# EAGLE board pc_badge_hrv (EAGLE 6.6.0)
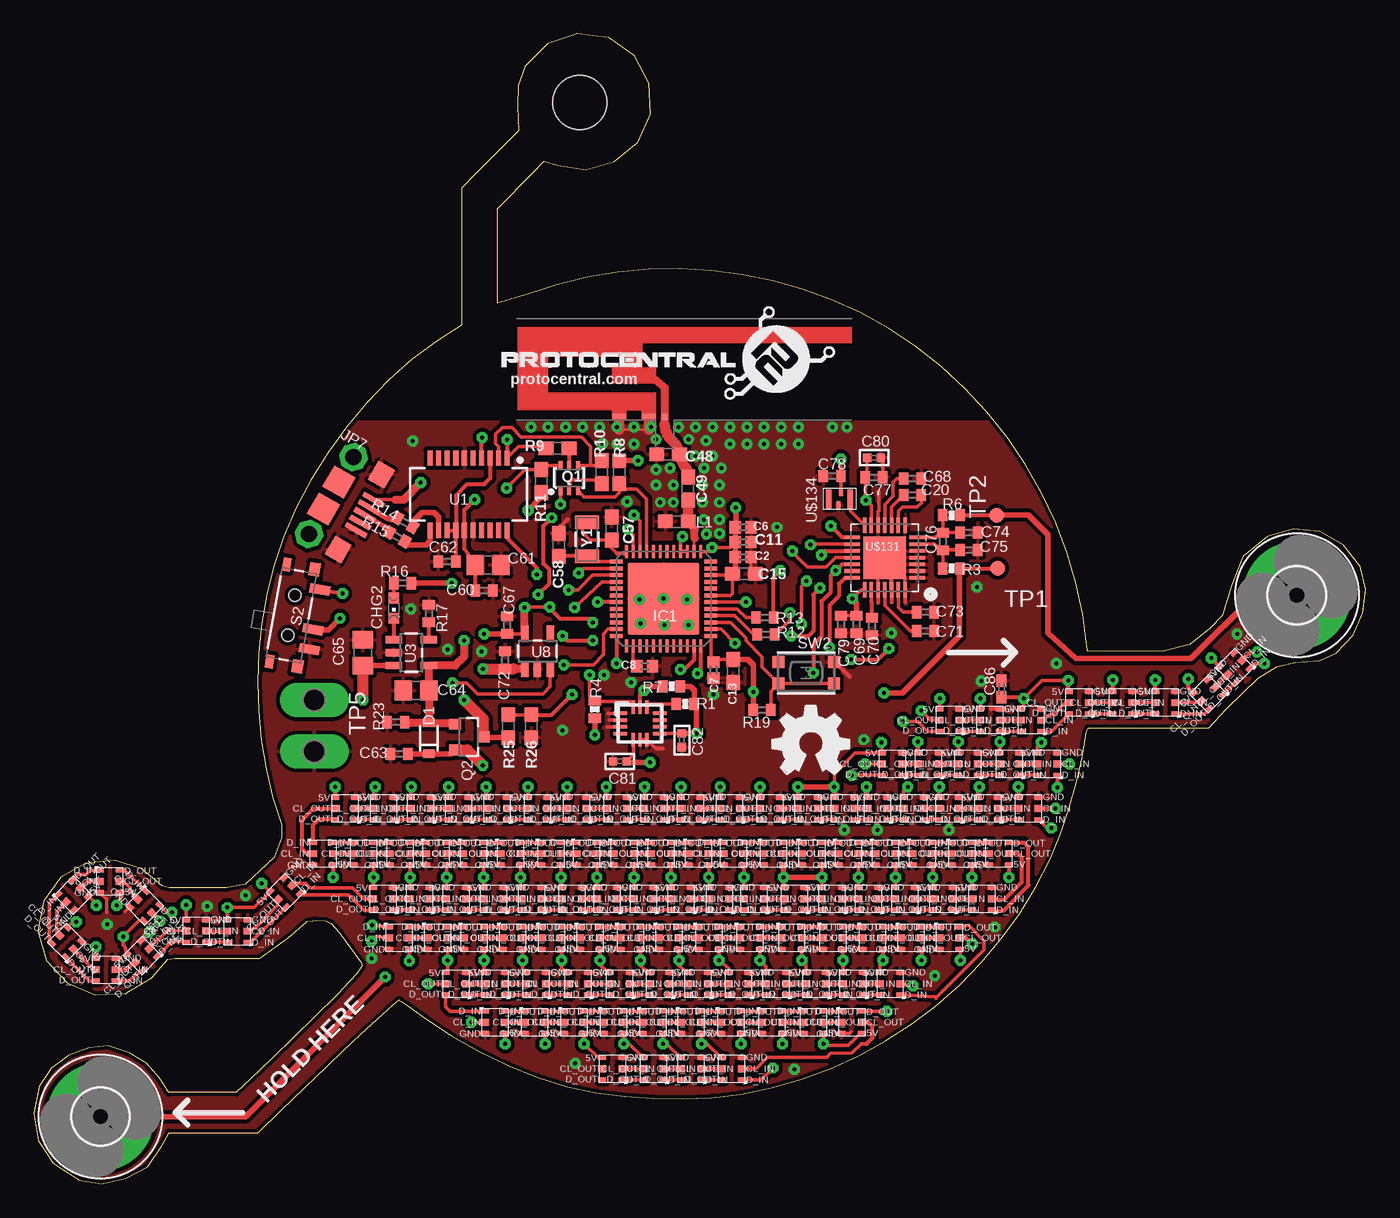
[diagram p3: board, top side]
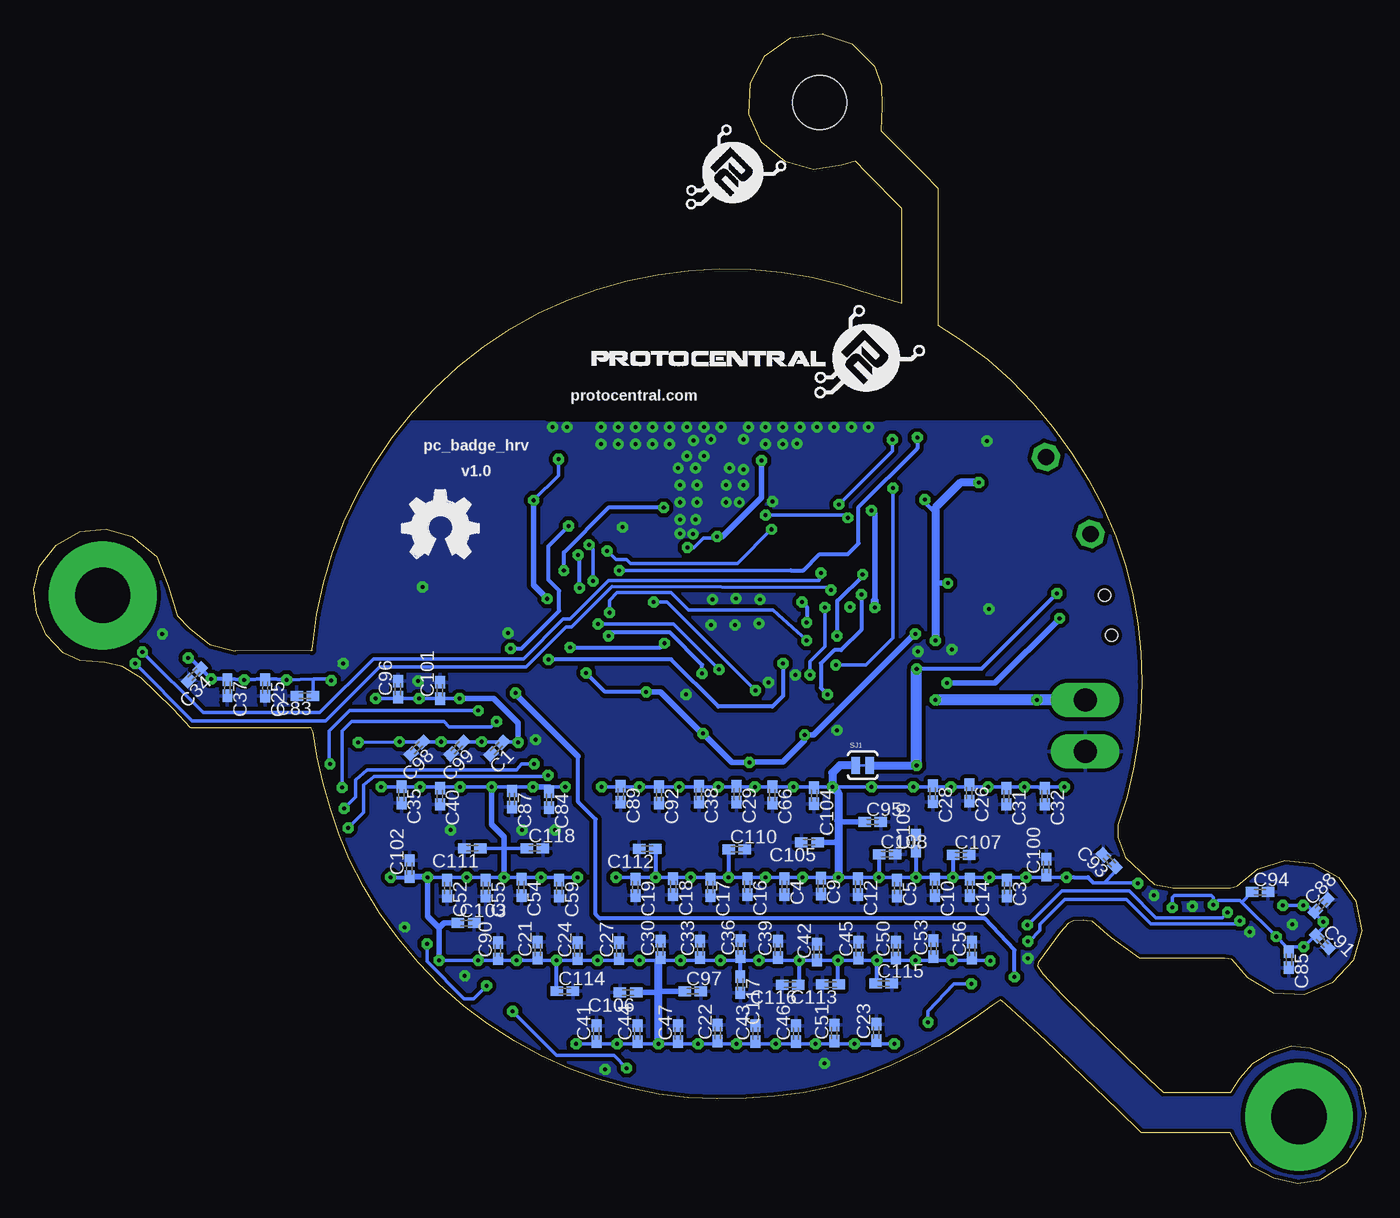
[diagram p4: board, bottom side, seen from below]

Size 98.76 x 85.28 mm. Coordinates in mm from the lower left corner, seen from the top.
Outline: 40.2,85.22 38.09,84.54 36.44,82.88 35.9,81.43 35.86,79.88 35.93,78.09 34.89,77.04 33.86,76 32.78,74.92 31.71,73.84 31.71,63.67 29.96,62.53 28.07,61.15 26.31,59.59 24.69,57.9 23.19,56.1 21.81,54.2 20.56,52.22 19.46,50.15 18.52,48 17.77,45.78 17.27,43.68 16.9,41.54 16.68,39.39 16.61,37.23 16.67,35.06 16.88,32.91 17.23,30.77 17.72,28.66 18.37,26.6 18.37,26.27 18.37,25.68 17.82,24.22 15.68,22.21 14.27,21.93
Outline: 14.31,21.94 10.05,21.96 9.53,22.09 8.02,23.34 5.99,24 3.87,23.76 2.01,22.71 0.75,20.99 0.31,18.76 0.95,16.58 2.47,14.9 4.55,14.01 6.81,14.12 8.75,15.27 9.95,16.64 10.46,16.73 16.73,16.73 18.86,18.24 20.28,19.45 20.69,19.51 20.94,19.52 21.66,19.5 22.06,19.3 22.65,18.65 23.47,17.54 24.29,16.43 24.33,16.17 23.94,15.57 22.44,13.98 20.88,12.44 19.27,10.87 17.66,9.31 16.04,7.75 15.01,6.78 10.02,6.78 9.35,7.84 8.36,8.95 7.07,9.7 5.54,10.25 4.12,10.1 2.6,9.54 1.31,8.58 0.42,7.23 0,5.23 0.34,3.22 1.45,1.51 3.22,0.39
Outline: 3.21,0.4 3.42,0.27 5.02,0 6.83,0.4 8.43,1.28 9.54,2.84 10.03,3.8 16.63,3.8 18.35,5.46 20.07,7.11 21.79,8.76 23.01,9.93 24.24,11.09 25.48,12.23 26.66,13.28 27,13.57 27.09,13.63 27.11,13.62 27.25,13.55 27.7,13.25 29.02,12.28 30.97,10.97 33.03,9.82 35.16,8.81 37.34,7.92 39.59,7.2 41.69,6.76 43.82,6.49 45.96,6.33 48.11,6.3 50.26,6.4 52.39,6.65 54.65,7.11 56.87,7.74 59.03,8.53 61.13,9.49 63.16,10.6 65.09,11.85 66.86,13.17 68.66,14.77 70.27,16.42 71.76,18.19 73.11,20.06 74.31,22.03 75.36,24.08 76.11,25.93 76.76,27.81 77.31,29.72 77.73,31.66 78.06,33.51 78.19,33.79 87.13,33.79 88.43,35.2 89.67,36.44 90.78,37.49 92.19,38.35 93.5,38.66 95.35,38.8 96.59,39.38 97.82,40.68 98.54,42.33 98.76,44.07 98.34,45.77 97.1,47.35 95.36,48.35 93.37,48.56 91.44,47.99 89.64,46.51 88.78,44.34 88.14,42.15 87.23,41.23 85.71,40 83.81,39.51
Outline: 78.14,39.5 78.09,39.83 77.78,42.21 77.27,44.56 76.59,46.86 75.73,49.1 74.7,51.27 73.51,53.35 72.17,55.34 70.68,57.21 69.05,58.97 67.29,60.6 65.4,62.09 63.41,63.42 61.31,64.59 59.12,65.57 56.96,66.35 54.74,66.96 52.49,67.42 50.21,67.71 47.92,67.84 45.62,67.81 43.33,67.6 41.06,67.23 38.83,66.68 36.65,65.95 34.38,65.32
Outline: 34.41,65.31 34.41,72.31 35.26,73.19 36.12,74.07 36.97,74.95 37.82,75.82 38.84,75.51 40.96,75.21 43.02,75.78 44.8,77.22 45.72,79.31 45.62,81.6 44.55,83.63 42.64,84.96 41.42,85.12 40.3,85.28 40.2,85.28
Outline: 78.1,39.53 83.82,39.52
Copper layers (1*2*15*16): Top 0.035mm / dielectric 1.5mm / Route2 0.035mm / dielectric 0.15mm / Route15 0.035mm / dielectric 0.2mm / Bottom 0.035mm
Design rules "Circuitects-Rules": minimum track width 6mil, minimum drill 0.3mm, track to track 6mil, track to pad 6mil, pad to pad 6mil, via to via 6mil, smd to smd 6mil, copper to edge 10mil, drill to drill 8mil, minimum pad ring 12mil, minimum via ring 10mil, stop-mask expansion 4mil, vias tented up to drill 25mil, thermal gap 10mil
Net classes: 2 gnd: width 0.102 mm, drill 0.1 mm; 4 USBpair: width 0.102 mm, drill 0.1 mm, clearance 0.15 mm to class 3
Holes 4 mm at 40.5,80.18

## Footprints (pad centres in the part's own frame; a part is rotated, then mirrored left to right if it is on the bottom)
C0402K = smd 0.925 x 0.74: 1 -0.6,0; 2 0.6,0
0402 = smd 0.85 x 0.9: 1 -0.58,0; 2 0.58,0
0603 = smd 1.1 x 1: 1 -0.85,0; 2 0.85,0
C0402 = smd 0.7 x 0.9: 1 -0.65,0; 2 0.65,0
C0805 = smd 1.3 x 1.5: 1 -0.95,0; 2 0.95,0
_0402 = smd 0.6 x 0.6: 1 -0.508,0; 2 0.508,0
CHIPLED_0603 = smd 0.8 x 0.8: A 0,-0.75; C 0,0.75
SOD-323 = smd 0.63 x 0.83: A 1.15,0; C -1.15,0
TRACE_ANTENNA_2.4GHZ_25.7MM_TUNED = smd 0.46 x 0.46: ANT 0,0.23 | smd 1 x 0.46: GND -1.18,0.23; GND2 -3.38,0.23
4,1-PAD = drill 4.1 pad 8: B4,1 0,0
QFN48 = smd 1 x 0.3: 1 -3.5,2.75; 2 -3.5,2.25; 3 -3.5,1.75; 4 -3.5,1.25; 5 -3.5,0.75; 6 -3.5,0.25; 7 -3.5,-0.25; 8 -3.5,-0.75; 9 -3.5,-1.25; 10 -3.5,-1.75; 11 -3.5,-2.25; 12 -3.5,-2.75; 25 3.5,-2.75; 26 3.5,-2.25; 27 3.5,-1.75; 28 3.5,-1.25; 29 3.5,-0.75; 30 3.5,-0.25; 31 3.5,0.25; 32 3.5,0.75; 33 3.5,1.25; 34 3.5,1.75; 35 3.5,2.25; 36 3.5,2.75 | smd 0.3 x 1: 13 -2.75,-3.5; 14 -2.25,-3.5; 15 -1.75,-3.5; 16 -1.25,-3.5; 17 -0.75,-3.5; 18 -0.25,-3.5; 19 0.25,-3.5; 20 0.75,-3.5; 21 1.25,-3.5; 22 1.75,-3.5; 23 2.25,-3.5; 24 2.75,-3.5; 37 2.75,3.5; 38 2.25,3.5; 39 1.75,3.5; 40 1.25,3.5; 41 0.75,3.5; 42 0.25,3.5; 43 -0.25,3.5; 44 -0.75,3.5; 45 -1.25,3.5; 46 -1.75,3.5; 47 -2.25,3.5; 48 -2.75,3.5 | smd 5.309 x 5.309: EXP 0,0
MICRO-B = smd 0.4 x 1.75: 1 -1.25,2.975; 2 -0.6,2.975; 3 0.05,2.975; 4 0.7,2.975; 5 1.35,2.975 | smd 1.8 x 1.8: P$1 -1.1,0.1; P$2 1.2,0.1 | drill 1.2 pad 2 octagon: P$3 -3.25,0.1; P$4 3.35,0.1 | smd 1.6 x 1.4: P$5 -3.15,2.55; P$6 3.25,2.55
SC70-6 = smd 0.3 x 0.66: 1 -0.65,-0.92; 2 0,-0.92; 3 0.65,-0.92; 4 0.65,0.92; 5 0,0.92; 6 -0.65,0.92
SOT23-3 = smd 0.8 x 0.9: 1 -0.95,-1; 2 0.95,-1; 3 0,1.1
0402-RES = smd 0.7 x 0.9: 1 -0.65,0; 2 0.65,0
R0402 = smd 0.7 x 0.9: 1 -0.65,0; 2 0.65,0
SWITCH-SPST-SMD-A = smd 0.7 x 1.5: 1 -2.25,-1.75; 2 -0.75,-1.75; 3 2.25,-1.75 | smd 1 x 0.6: GND1 -3.65,1; GND3 3.65,1 | smd 1 x 0.8: GND2 -3.65,-1.1; GND4 3.65,-1.1 | hole 0.9: -1.5,0; 1.5,0
SJ_2S-TRACE = smd 0.635 x 1.27: 1 -0.508,0; 2 0.508,0
BTN_KMR2_4.6X2.8 = smd 0.9 x 0.9: A 2.05,0.8; A' -2.05,0.8; B 2.05,-0.8; B' -2.05,-0.8
TP11R = smd 1.1 x 1.1: TP 0,0
P2-38-17 = drill 1.702 pad 2.121 long: TP-1 -1.905,0; TP-2 1.905,0
SSOP20_L = smd 0.381 x 1.143: 1 -2.857,-2.68; 2 -2.223,-2.68; 3 -1.587,-2.68; 4 -0.953,-2.68; 5 -0.318,-2.68; 6 0.318,-2.68; 7 0.953,-2.68; 8 1.587,-2.68; 9 2.223,-2.68; 10 2.857,-2.68; 11 2.857,2.68; 12 2.223,2.68; 13 1.587,2.68; 14 0.953,2.68; 15 0.318,2.68; 16 -0.318,2.68; 17 -0.953,2.68; 18 -1.587,2.68; 19 -2.223,2.68; 20 -2.857,2.68
LGA14L = smd 1 x 0.25: 1 -1.45,0.75; 2 -1.45,0.25; 3 -1.45,-0.25; 4 -1.45,-0.75; 8 1.45,-0.75; 9 1.45,-0.25; 10 1.45,0.25; 11 1.45,0.75 | smd 0.25 x 1: 5 -0.5,-1.2; 6 0,-1.2; 7 0.5,-1.2; 12 0.5,1.2; 13 0,1.2; 14 -0.5,1.2
SOT23-5 = smd 0.55 x 1.2: 1 -0.95,-1.3; 2 0,-1.3; 3 0.95,-1.3; 4 0.95,1.3; 5 -0.95,1.3
APA102_2020 = smd 0.6 x 0.5: C_IN 0.25,1; CL_OUT 1.75,1 | smd 0.6 x 0.35: D_IN 0.25,1.825; D_OUT 1.75,1.825; GND 0.25,0.175; V_CC 1.75,0.175
QFN-28 = smd 1.15 x 0.27: 1 -2.4,1.5; 2 -2.4,1; 3 -2.4,0.5; 4 -2.4,0; 5 -2.4,-0.5; 6 -2.4,-1; 7 -2.4,-1.5; 15 2.4,-1.5; 16 2.4,-1; 17 2.4,-0.5; 18 2.4,0; 19 2.4,0.5; 20 2.4,1; 21 2.4,1.5 | smd 0.27 x 1.15: 8 -1.5,-2.4; 9 -1,-2.4; 10 -0.5,-2.4; 11 0,-2.4; 12 0.5,-2.4; 13 1,-2.4; 14 1.5,-2.4; 22 1.5,2.4; 23 1,2.4; 24 0.5,2.4; 25 0,2.4; 26 -0.5,2.4; 27 -1,2.4; 28 -1.5,2.4 | smd 3.15 x 3.15: THERMAL 0,0
SIT1533 = smd 0.4 x 1.4: 1 -0.8,0; 3 0.8,0 | smd 0.3 x 0.5: 2 -0.1,-0.45; 4 0.1,0.45
CRYSTAL-SMD-3.2X1.5MM = smd 1 x 1.8: P$1 -1.25,0; P$2 1.25,0

## Placement (x,y rotation side)
C1  [C0402K]  64.43,32.3 225 bottom
C2  0.1uF  [0402]  52.6,46.48 0 top
C3  [C0402K]  26.6,21.93 270 bottom
C4  [C0402K]  43.1,22.03 270 bottom
C5  [C0402K]  34.75,21.93 270 bottom
C6  0.1uF  [0402]  52.6,48.68 0 top
C7  0.1uF  [0402]  50.4,38.08 270 top
C8  0.1uF  [0402]  45.3,38.38 0 top
C9  [C0402K]  40.4,22.08 270 bottom
C10  [C0402K]  31.95,21.98 270 bottom
C11  0.1uF  [0402]  52.6,47.58 0 top
C12  [C0402K]  37.65,22.03 270 bottom
C13  10uF  [0603]  51.85,38.03 270 top
C14  [C0402K]  29.35,21.98 270 bottom
C15  10uF  [0603]  52.65,45.23 0 top
C16  [C0402K]  45.85,22.03 270 bottom
C17  [C0402K]  48.6,21.98 270 bottom
C18  [C0402K]  51.35,22.03 270 bottom
C19  [C0402K]  54.15,21.98 270 bottom
C20  1uF  [C0402]  65.15,51.08 180 top
C21  [C0402K]  61.4,17.33 90 bottom
C22  [C0402K]  48.05,11.18 90 bottom
C23  [C0402K]  36.3,11.23 90 bottom
C24  [C0402K]  58.45,17.28 90 bottom
C25  [C0402K]  81.6,36.77 270 bottom
C26  [C0402K]  29.4,28.98 270 bottom
C27  [C0402K]  55.35,17.28 90 bottom
C28  [C0402K]  32.1,28.93 270 bottom
C29  [C0402K]  46.65,28.88 270 bottom
C30  [C0402K]  52.3,17.38 90 bottom
C31  [C0402K]  26.65,28.73 270 bottom
C32  [C0402K]  23.8,28.73 270 bottom
C33  [C0402K]  49.35,17.38 90 bottom
C34  [C0402K]  86.85,37.75 225 bottom
C35  [C0402K]  71.5,28.83 270 bottom
C36  [C0402K]  46.35,17.43 90 bottom
C37  [C0402K]  84.4,36.78 270 bottom
C38  [C0402K]  49.45,28.88 270 bottom
C39  [C0402K]  43.6,17.38 90 bottom
C40  [C0402K]  68.65,28.73 270 bottom
C41  [C0402K]  57.05,11.13 90 bottom
C42  [C0402K]  40.7,17.18 90 bottom
C43  [C0402K]  45.25,11.13 90 bottom
C44  [C0402K]  54,11.13 90 bottom
C45  [C0402K]  37.6,17.33 90 bottom
C46  [C0402K]  42.25,11.13 90 bottom
C47  [C0402K]  51,11.13 90 bottom
C48  2.4pF  [0603]  47.04,54.09 180 top
C49  5.6pF  [0603]  48.51,51.55 90 top
C50  [C0402K]  34.85,17.33 90 bottom
C51  [C0402K]  39.4,11.18 90 bottom
C52  [C0402K]  68.1,21.93 270 bottom
C53  [C0402K]  32.05,17.43 90 bottom
C54  [C0402K]  62.6,21.98 270 bottom
C55  [C0402K]  65.25,21.93 270 bottom
C56  [C0402K]  29.2,17.33 90 bottom
C57  15pF  [0603]  42.86,48.59 270 top
C58  15pF  [0603]  38.92,47.38 270 top
C59  [C0402K]  59.8,21.93 270 bottom
C60  0.1uF  [C0402]  33.4,43.98 0 top
C61  10uF  [C0805]  33.7,45.88 0 top
C62  0.1uF  [C0402]  30.65,46.13 180 top
C63  1.0uF  [C0402]  27.1,31.88 180 top
C64  4.7u  [C0805]  28.35,36.58 180 top
C65  4.7u  [C0805]  24.4,39.38 90 top
C66  [C0402K]  44,28.83 270 bottom
C67  2.2uF  [C0402]  35.1,41.43 90 top
C68  1nF  [C0402]  65.15,52.28 0 top
C69  1uF  [C0402]  61,41.48 270 top
C70  10uF  [C0402]  62.15,41.33 270 top
C71  10uF  [C0402]  66.1,40.98 0 top
C72  1u  [C0402]  34.95,38.83 270 top
C73  1uF  [C0402]  66.1,42.38 0 top
C74  10pF  [C0402]  69.35,48.28 0 top
C75  10pF  [C0402]  69.35,46.98 0 top
C76  1000pF  [C0402]  67.4,47.63 90 top
C77  10uF  [C0402]  62.3,52.38 0 top
C78  1uF  [C0402]  59.2,52.48 180 top
C79  10uF  [C0402]  59.85,41.48 270 top
C80  1uF  [_0402]  62.3,53.83 0 top
C81  100nF  [_0402]  43.45,31.33 180 top
C82  100nF  [_0402]  48.05,32.88 270 top
C83  [C0402K]  78.65,36.18 180 bottom
C84  [C0402K]  60.55,28.49 270 bottom
C85  [C0402K]  5.7,16.63 270 bottom
C86  [C0402K]  71.75,36.69 90 top
C87  [C0402K]  63.3,28.53 270 bottom
C88  [C0402K]  3.31,20.63 45 bottom
C89  [C0402K]  55.25,28.88 270 bottom
C90  [C0402K]  64.35,17.28 90 bottom
C91  [C0402K]  3.22,17.97 315 bottom
C92  [C0402K]  52.4,28.83 270 bottom
C93  [C0402K]  19.02,23.96 135 bottom
C94  [C0402K]  7.85,21.63 0 bottom
C95  [C0402K]  36.55,26.83 0 bottom
C96  [C0402K]  71.75,36.68 90 bottom
C97  [C0402K]  49.9,14.28 0 bottom
C98  [C0402K]  70.36,32.32 225 bottom
C99  [C0402K]  67.39,32.31 225 bottom
C100  [C0402K]  23.7,23.48 90 bottom
C101  [C0402K]  68.65,36.58 90 bottom
C102  [C0402K]  70.9,23.38 90 bottom
C103  [C0402K]  66.7,19.33 0 bottom
C104  [C0402K]  40.9,28.78 270 bottom
C105  [C0402K]  41.25,25.33 180 bottom
C106  [C0402K]  54.7,14.18 180 bottom
C107  [C0402K]  30,24.39 0 bottom
C108  [C0402K]  35.49,24.43 0 bottom
C109  [C0402K]  33.36,25.27 90 bottom
C110  [C0402K]  46.64,24.8 0 bottom
C111  [C0402K]  66.25,24.88 180 bottom
C112  [C0402K]  53.27,24.84 180 bottom
C113  [C0402K]  39.69,14.78 180 bottom
C114  [C0402K]  59.38,14.29 0 bottom
C115  [C0402K]  35.74,14.85 0 bottom
C116  [C0402K]  42.68,14.77 180 bottom
C117  [C0402K]  46.38,14.76 270 bottom
C118  [C0402K]  61.6,24.88 0 bottom
CHG2  RED  [CHIPLED_0603]  26.7,42.68 180 top
D1  BAT20J  [SOD-323]  29.3,33.03 90 top
E1  ANTENNA  [TRACE_ANTENNA_2.4GHZ_25.7MM_TUNED]  46.78,56.63 0 top
H1  MOUNT-PAD-ROUND4.1  [4,1-PAD]  4.95,4.98 0 top
H2  MOUNT-PAD-ROUND4.1  [4,1-PAD]  93.65,43.63 0 top
IC1  CY8C29666_QFN48  [QFN48]  46.7,43.38 270 top
JP7  MICRO-B  [MICRO-B]  21.99,51.13 240 top
L1  2.7nH  [0603]  47.67,49.11 180 top
LOGO2  OSHW_LOGO_FILLX0200-NT  [OSHW_FILLX200_NOTEXT]  71.44,46.37 0 bottom
LOGO3  OSHW_LOGO_FILLX0200-NT  [OSHW_FILLX200_NOTEXT]  54.78,30.37 0 top
Q1  MBT3904DW1T1  [SC70-6]  39.7,52.32 0 top
Q2  2.5A/30V  [SOT23-3]  32.25,33.13 270 top
R1  10K  [0402-RES]  48.3,35.58 0 top
R3  49.9K  [0402-RES]  68.05,45.63 180 top
R4  10K  [0402-RES]  41.6,35.18 270 top
R6  49.9K  [0402-RES]  68.05,49.58 180 top
R7  10K  [0402-RES]  47.3,36.88 0 top
R8  10k  [0603]  43.43,52.76 90 top
R9  10k  [0603]  38.83,54.53 0 top
R10  10k  [0603]  42.13,52.78 270 top
R11  10k  [0603]  37.63,52.11 270 top
R12  1K  [R0402]  54.3,40.73 0 top
R13  1K  [R0402]  54.2,41.98 0 top
R14  27  [R0402]  27.54,49.05 330 top
R15  27  [R0402]  26.95,47.97 330 top
R16  330R  [R0402]  27.35,44.53 180 top
R17  1k  [R0402]  29.3,42.28 270 top
R19  10K  [R0402]  54,35.13 180 top
R23  10K  [R0402]  26.85,34.23 0 top
R25  10k  [0603]  35.2,33.93 270 top
R26  10k  [0603]  36.9,33.93 90 top
S2  PCM12SMTR  [SWITCH-SPST-SMD-A]  19.11,42.16 80 top
SJ1  SOLDERJUMPERTRACE  [SJ_2S-TRACE]  37.3,31.03 0 bottom
SW2  KMR2  [BTN_KMR2_4.6X2.8]  57.27,37.89 0 top
TP1  TPSQTP11R  [TP11R]  71.45,45.63 90 top
TP2  TPSQTP11R  [TP11R]  71.4,49.58 90 top
TP5  PTR2  [P2-38-17]  20.8,33.98 270 top
U1  FTS31XS-U  [SSOP20_L]  32.25,51.13 180 top
U2  LSM6DS3  [LGA14L]  44.95,34.13 0 top
U3  MCP73831  [SOT23-5]  28,39.38 270 top
U8  AP2112K-3.3V  [SOT23-5]  37.35,39.48 0 top
U$1  PROTY_LOGO_WITH_TEXT  [PROTY_WITH_TEXT@1]  57.39,58.61 0 bottom
U$6  [LOGO-PROTY]  50.47,72.15 0 bottom
U$9  APA1022020  [APA102_2020]  89.06,39.7 225 top
U$10  APA1022020  [APA102_2020]  87.08,37.74 225 top
U$11  APA1022020  [APA102_2020]  84.9,36.68 180 top
U$12  APA1022020  [APA102_2020]  81.7,36.68 180 top
U$13  APA1022020  [APA102_2020]  78.5,36.68 180 top
U$14  APA1022020  [APA102_2020]  74.95,35.38 180 top
U$15  APA1022020  [APA102_2020]  71.9,35.38 180 top
U$18  APA1022020  [APA102_2020]  68.9,35.38 180 top
U$19  APA1022020  [APA102_2020]  76.15,32.13 180 top
U$20  APA1022020  [APA102_2020]  73.35,32.13 180 top
U$21  APA1022020  [APA102_2020]  70.25,32.13 180 top
U$22  APA1022020  [APA102_2020]  67.35,32.13 180 top
U$24  APA1022020  [APA102_2020]  64.65,32.13 180 top
U$25  APA1022020  [APA102_2020]  74.75,28.83 180 top
U$26  PROTY_LOGO_WITH_TEXT  [PROTY_WITH_TEXT@1]  34.69,58.51 0 top
U$27  APA1022020  [APA102_2020]  71.75,28.83 180 top
U$28  APA1022020  [APA102_2020]  68.85,28.83 180 top
U$29  APA1022020  [APA102_2020]  66.25,28.83 180 top
U$30  APA1022020  [APA102_2020]  63.55,28.83 180 top
U$31  APA1022020  [APA102_2020]  61.1,28.83 180 top
U$32  APA1022020  [APA102_2020]  20.45,23.48 0 top
U$33  APA1022020  [APA102_2020]  23.45,23.48 0 top
U$34  APA1022020  [APA102_2020]  26.15,23.48 0 top
U$35  APA1022020  [APA102_2020]  28.85,23.48 0 top
U$36  APA1022020  [APA102_2020]  31.6,23.48 0 top
U$37  APA1022020  [APA102_2020]  34.35,23.48 0 top
U$38  APA1022020  [APA102_2020]  37.35,23.48 0 top
U$39  APA1022020  [APA102_2020]  40,23.48 0 top
U$40  APA1022020  [APA102_2020]  42.75,23.48 0 top
U$41  APA1022020  [APA102_2020]  45.5,23.48 0 top
U$42  APA1022020  [APA102_2020]  48.3,23.48 0 top
U$43  APA1022020  [APA102_2020]  50.9,23.48 0 top
U$44  APA1022020  [APA102_2020]  53.85,23.48 0 top
U$45  APA1022020  [APA102_2020]  56.7,23.48 0 top
U$46  APA1022020  [APA102_2020]  59.4,23.48 0 top
U$47  APA1022020  [APA102_2020]  62.15,23.48 0 top
U$48  APA1022020  [APA102_2020]  64.9,23.48 0 top
U$49  APA1022020  [APA102_2020]  67.8,23.48 0 top
U$50  APA1022020  [APA102_2020]  70.55,23.48 0 top
U$51  APA1022020  [APA102_2020]  71.3,22.13 180 top
U$52  APA1022020  [APA102_2020]  68.4,22.13 180 top
U$53  APA1022020  [APA102_2020]  65.6,22.13 180 top
U$54  APA1022020  [APA102_2020]  62.9,22.13 180 top
U$55  APA1022020  [APA102_2020]  60.2,22.13 180 top
U$56  APA1022020  [APA102_2020]  57.4,22.13 180 top
U$57  APA1022020  [APA102_2020]  54.4,22.13 180 top
U$58  APA1022020  [APA102_2020]  51.85,22.13 180 top
U$59  APA1022020  [APA102_2020]  49,22.13 180 top
U$60  APA1022020  [APA102_2020]  46.2,22.13 180 top
U$61  APA1022020  [APA102_2020]  43.5,22.13 180 top
U$62  APA1022020  [APA102_2020]  40.9,22.13 180 top
U$63  APA1022020  [APA102_2020]  37.9,22.13 180 top
U$64  APA1022020  [APA102_2020]  35.1,22.13 180 top
U$65  APA1022020  [APA102_2020]  32.3,22.13 180 top
U$66  APA1022020  [APA102_2020]  29.6,22.13 180 top
U$67  APA1022020  [APA102_2020]  26.9,22.13 180 top
U$68  APA1022020  [APA102_2020]  18.63,23.01 225 top
U$69  APA1022020  [APA102_2020]  16.1,19.73 180 top
U$70  APA1022020  [APA102_2020]  13.05,19.75 180 top
U$71  APA1022020  [APA102_2020]  8.04,18.34 225 top
U$72  APA1022020  [APA102_2020]  6.35,16.88 180 top
U$73  APA1022020  [APA102_2020]  3.85,17.9 135 top
U$74  APA1022020  [APA102_2020]  2.92,19.99 45 top
U$75  APA1022020  [APA102_2020]  4.65,21.43 0 top
U$76  APA1022020  [APA102_2020]  6.82,20.6 315 top
U$77  APA1022020  [APA102_2020]  26.1,17.23 0 top
U$78  APA1022020  [APA102_2020]  28.95,17.23 0 top
U$79  APA1022020  [APA102_2020]  31.65,17.23 0 top
U$80  APA1022020  [APA102_2020]  34.5,17.23 0 top
U$81  APA1022020  [APA102_2020]  37.4,17.23 0 top
U$82  APA1022020  [APA102_2020]  40.25,17.23 0 top
U$83  APA1022020  [APA102_2020]  43.25,17.23 0 top
U$84  APA1022020  [APA102_2020]  46.1,17.23 0 top
U$85  APA1022020  [APA102_2020]  49.05,17.23 0 top
U$86  APA1022020  [APA102_2020]  52.1,17.23 0 top
U$87  APA1022020  [APA102_2020]  55.2,17.23 0 top
U$88  APA1022020  [APA102_2020]  58.25,17.23 0 top
U$89  APA1022020  [APA102_2020]  61.2,17.23 0 top
U$90  APA1022020  [APA102_2020]  64.05,17.23 0 top
U$91  APA1022020  [APA102_2020]  66.9,17.23 0 top
U$92  APA1022020  [APA102_2020]  64.5,15.83 180 top
U$93  APA1022020  [APA102_2020]  61.75,15.83 180 top
U$94  APA1022020  [APA102_2020]  59,15.83 180 top
U$95  APA1022020  [APA102_2020]  56.05,15.83 180 top
U$96  APA1022020  [APA102_2020]  53.25,15.83 180 top
U$97  APA1022020  [APA102_2020]  50.25,15.83 180 top
U$98  APA1022020  [APA102_2020]  47.4,15.83 180 top
U$99  APA1022020  [APA102_2020]  44.45,15.83 180 top
U$100  APA1022020  [APA102_2020]  41.35,15.83 180 top
U$101  APA1022020  [APA102_2020]  38.25,15.83 180 top
U$102  APA1022020  [APA102_2020]  35.2,15.83 180 top
U$103  APA1022020  [APA102_2020]  32.3,15.83 180 top
U$104  APA1022020  [APA102_2020]  55.6,28.83 180 top
U$105  APA1022020  [APA102_2020]  33.2,10.98 0 top
U$106  APA1022020  [APA102_2020]  36.15,10.98 0 top
U$107  APA1022020  [APA102_2020]  39.05,10.98 0 top
U$108  APA1022020  [APA102_2020]  42,10.98 0 top
U$109  APA1022020  [APA102_2020]  44.9,10.98 0 top
U$110  APA1022020  [APA102_2020]  47.75,10.98 0 top
U$111  APA1022020  [APA102_2020]  50.7,10.98 0 top
U$112  APA1022020  [APA102_2020]  53.75,10.98 0 top
U$113  APA1022020  [APA102_2020]  56.8,10.98 0 top
U$114  APA1022020  [APA102_2020]  59.65,10.98 0 top
U$115  APA1022020  [APA102_2020]  52.75,9.53 180 top
U$116  APA1022020  [APA102_2020]  49.75,9.53 180 top
U$117  APA1022020  [APA102_2020]  46.95,9.53 180 top
U$118  APA1022020  [APA102_2020]  43.9,9.53 180 top
U$119  APA1022020  [APA102_2020]  52.6,28.83 180 top
U$120  APA1022020  [APA102_2020]  49.7,28.83 180 top
U$121  APA1022020  [APA102_2020]  47,28.83 180 top
U$122  APA1022020  [APA102_2020]  44.25,28.83 180 top
U$123  APA1022020  [APA102_2020]  41.25,28.83 180 top
U$124  APA1022020  [APA102_2020]  38.35,28.83 180 top
U$125  APA1022020  [APA102_2020]  35.35,28.83 180 top
U$126  APA1022020  [APA102_2020]  32.5,28.83 180 top
U$127  APA1022020  [APA102_2020]  29.7,28.83 180 top
U$128  APA1022020  [APA102_2020]  26.95,28.83 180 top
U$129  APA1022020  [APA102_2020]  24.1,28.83 180 top
U$130  APA1022020  [APA102_2020]  58.4,28.83 180 top
U$131  MAX30003CTI+  [QFN-28]  63.1,46.43 180 top
U$134  SIT1533  [SIT1533]  59.75,50.78 0 top
Y1  32.768kHz  [CRYSTAL-SMD-3.2X1.5MM]  41.02,47.79 270 top

## Tracks (layer width: path | path; a pad name or v marks a point on that pad's centre or on a via)
0  (via drill 0.3)
  Top 0.254: Q1.6 37.31,53.24 R11.1 36.43,52.96 v35.05,51.58 | IC1.23 42.6,41.13 42.25,40.78 42.25,39.23 41.5,38.48 v39.3,38.48
  Bottom 0.254: v39.3,38.48 37.05,38.48 35.05,40.48 v35.05,51.58
3.3V  (via drill 0.3)
  Top 0.254: IC1.1 50,46.88 v50.3,47.18 51.62,47.18 C11.1 | IC1.4 47.95,47.83 v48.1,47.98 | C7.1 50.2,38.86 IC1.37 50.2,38.78 50.3,38.88 C13.1 | C67.1 | C67.1 U8.5 | C82.1 U2.8 | 49.15,35.38 R1.2 48.95,35.88 | U2.5 44.45,31.83 C81.1 44.05,31.23 | IC1.46 51.7,45.13 C15.1 51.8,43.78 51.65,43.63 IC1.43 | v38.25,42.78 36.45,42.78 v36.4,42.73
  Top 0.305: IC1.3 IC1.4 | IC1.19 v41.8,43.13 | v41.45,41.63 41.2,41.88 39.05,41.88 38.25,42.68 v38.25,42.78 | U$131.19 59.93,45.93 v59.46,45.46 59.1,45.1 59.1,43.88 58.4,43.18 58.4,40.58 57.8,39.98 v57.8,37.88
  Top 0.406: C13.1 52.95,38.88 53.35,38.48 v53.35,36.48 R19.2 | 44.05,31.23 v45.7,31.23 | C82.1 v49.15,33.38 49.15,35.38 | R7.2 48.7,36.88 49,36.58 49,35.63 R1.2 | C67.1 v33.4,40.78 | R4.2 v41.6,33.28 | R8.2 44.78,53.61 v44.8,53.63 | v52.05,50.13 52.05,48.71 C6.1 C11.1 C2.1 52.02,45.45 C15.1 | R11.2 37.63,50.91 v36.65,49.93
  Top 0.61: U8.5 v36.4,42.73
  Bottom 0.254: v50.3,47.18 49.8,47.18 49.1,47.88 48.2,47.88 v48.1,47.98
  Bottom 0.305: v41.8,43.13 41.45,42.78 v41.45,41.63 | v52.06,50.12 v52.05,50.13 56.15,50.13 59.46,46.82 v59.46,45.46 | v53.35,36.48 56.4,36.48 v57.8,37.88
  Bottom 0.406: v53.35,36.48 52.3,36.48 49.2,33.38 v49.15,33.38 47,31.23 v45.7,31.23 45.65,31.28 43.2,31.28 41.6,32.88 v41.6,33.28 | v41.6,33.28 40.95,33.28 33.4,40.83 v33.4,40.78 | 41.65,33.28 v41.6,33.28 | 36.6,49.88 v36.65,49.93 36.4,49.68 36.4,43.23 | v44.8,53.63 44.8,50.88 47.7,47.98 v48.1,47.98
  Bottom 0.61: v36.4,42.73 36.4,43.23
3.3V_F
  Top 0.305: U1.3 33.83,52.32 33.4,51.88 32.15,51.88 31.3,51.03 U1.14 | U1.13 U1.14 | C62.1 U1.14
32K_XN
  Top 0.254: IC1.13 41.36,46.13 Y1.P$2
  Top 0.305: Y1.P$2 38.93,46.54 C58.2
32K_XP
  Top 0.254: 43.25,46.73 42.71,47.27 C57.2 41.24,47.74 40.7,48.28 40.7,49.07 Y1.P$1
  Top 0.305: IC1.12 43.8,46.73 43.25,46.73
+1.8V  (via drill 0.3)
  Top 0.254: U$131.13 62.1,50.28 v61.7,50.68 61.65,50.73 C77.1 61.79,52.53 C80.1 | C78.1 U$134.4 v59.85,53.73 | C69.1 C79.1 | U$131.22 61.35,44.03 v60.7,43.38
  Top 0.406: C69.1 61,43.08 v60.7,43.38
  Bottom 0.254: v59.85,53.73 59.85,52.53 v61.7,50.68
  Bottom 0.406: v61.7,50.68 61.7,44.38 v60.7,43.38
+5V  (via drill 0.3)
  Top 0.254: U$18.V_CC 67.2,35.26 v67.2,35.98 | U$15.V_CC 70.2,35.26 v70.2,35.98 | U$14.V_CC 73.4,35.26 v73.4,35.98 74.73,37.31 v76.7,37.31 | U$20.V_CC 71.65,31.91 v71.65,32.78 | U$21.V_CC 68.55,32.01 v68.55,32.78 | U$22.V_CC 65.55,32.01 v65.55,32.78 | U$25.V_CC v73,29.43 | U$30.V_CC 61.75,28.71 | 64.55,28.71 U$29.V_CC 64.5,29.13 v64.8,29.43 | U$28.V_CC 67.1,29.28 v67.15,29.43 | U$27.V_CC 70,29.33 v70.1,29.43 | U$51.V_CC v69.55,22.73 | U$52.V_CC v66.65,22.73 | U$53.V_CC 63.9,21.91 v63.9,22.73 | U$54.V_CC v61.15,22.73 U$46.V_CC | U$55.V_CC v58.45,22.73 U$45.V_CC | U$56.V_CC 55.6,21.91 v55.6,22.73 | U$57.V_CC v52.65,22.73 U$43.V_CC | U$58.V_CC 50.05,21.96 v50.05,22.73 U$42.V_CC | U$59.V_CC v47.25,22.73 U$41.V_CC | U$60.V_CC 44.5,21.96 v44.5,22.73 U$40.V_CC | U$61.V_CC v41.75,22.73 U$39.V_CC | U$62.V_CC 39.1,21.96 v39.1,22.73 U$38.V_CC | U$63.V_CC 36.1,21.96 v36.1,22.73 U$37.V_CC | U$64.V_CC v33.35,22.73 U$36.V_CC | U$65.V_CC 30.6,21.96 v30.6,22.73 U$35.V_CC | U$66.V_CC 27.9,21.96 v27.9,22.73 U$34.V_CC | U$67.V_CC 25.2,21.96 v25.2,22.73 U$33.V_CC | U$74.V_CC 4.75,20.64 v4.65,20.63 | v6.15,20.63 6.4,20.88 U$75.V_CC | U$73.V_CC 2.9,19.43 v3.15,19.43 | U$72.V_CC v4.6,17.58 | U$71.V_CC 6.8,17.51 6.8,17.53 6.65,17.68 v6.65,18.33 7.8,19.48 U$76.V_CC | U$70.V_CC 11.3,19.83 v11.3,20.68 | U$69.V_CC v14.35,20.48 16.35,20.48 U$68.V_CC v16.9,22.28 | U$77.V_CC v27.85,16.53 | v68.7,16.58 68.7,17.51 U$91.V_CC | U$78.V_CC v30.7,16.58 30.7,15.81 U$103.V_CC | U$79.V_CC v33.4,16.58 33.4,15.71 U$102.V_CC | U$80.V_CC v36.25,16.58 36.25,15.91 U$101.V_CC | U$81.V_CC v39.15,16.58 39.15,15.96 U$100.V_CC | U$82.V_CC v42,16.58 42,16.21 U$99.V_CC
  Top 0.254: U$83.V_CC v45,16.58 45,16.16 U$98.V_CC | U$84.V_CC v47.85,16.58 47.85,16.16 U$97.V_CC | U$105.V_CC v34.95,10.38 | U$113.V_CC v58.55,10.38 58.65,10.28 60.4,10.28 60.6,10.48 60.62,10.48 61.29,11.16 U$114.V_CC | U$112.V_CC v55.5,10.38 | U$111.V_CC v52.45,10.38 | U$110.V_CC v49.5,10.38 49.92,10.38 U$115.V_CC | U$109.V_CC v46.65,10.38 46.92,10.38 U$116.V_CC | U$108.V_CC v43.75,10.38 44.12,10.38 U$117.V_CC | U$107.V_CC v40.8,10.38 41.87,9.36 U$118.V_CC | U$106.V_CC v37.9,10.38 | U$86.V_CC v53.85,16.58 54.3,16.13 U$95.V_CC | U$87.V_CC v56.95,16.58 57.25,16.28 U$94.V_CC | U$88.V_CC v60,16.58 U$93.V_CC | U$96.V_CC 51.5,16.03 v50.8,16.58 | v62.95,16.58 62.75,16.38 U$92.V_CC | U$130.V_CC v56.65,29.43 | v22.35,29.43 U$129.V_CC | U$104.V_CC v53.85,29.43 | U$128.V_CC 25.2,29.33 v25.3,29.43 | U$124.V_CC 36.65,28.66 v36.65,29.43 | U$123.V_CC 39.55,28.66 v39.55,29.43 | U$122.V_CC 42.45,28.66 v42.45,29.43 | U$121.V_CC 45.3,28.66 v45.3,29.43 | U$120.V_CC 48,28.66 v48,29.43 | U$119.V_CC 50.9,28.66 v50.9,29.43 | U$31.V_CC v59.35,29.43 59.35,30.38 60.9,31.93 62.87,31.93 U$24.V_CC 62.9,32.68 v62.85,32.73 | U$19.V_CC 74.4,32.43 v74.7,32.73
  Top 0.305: U$85.V_CC v50.8,16.58 | U$90.V_CC v65.8,16.58 | U$89.V_CC v62.95,16.58 | U$50.V_CC v72.3,22.73 | U$49.V_CC v69.55,22.73 | U$48.V_CC v66.65,22.73 | U$47.V_CC v63.9,22.73 | U$32.V_CC v22.2,22.73 | U$127.V_CC 28,28.66 v28,29.43 | U$126.V_CC v30.75,29.43 | U$125.V_CC 33.55,28.66 v33.55,29.43 | v87.3,38.98 U$9.V_CC | U$13.V_CC 76.7,36.56 v76.7,37.31 | U$12.V_CC 80,36.56 v80.01,37.37 | U$11.V_CC v83.15,37.37 | U$10.V_CC 85.6,36.75 v85.6,37.43 | 73.4,36.08 v73.4,35.98 73.4,36.09 C86.1
  Top 0.406: U$44.V_CC v55.6,22.73 v58.45,22.73 | v59.35,29.43 56.7,29.43 | 61.75,28.71 v61.75,29.43 | U$31.V_CC 59.4,28.71 59.4,29.43
  Bottom 0.254: v67.2,35.98 C101.1 v70.2,35.98 71.7,35.98 | 71.7,35.98 v73.4,35.98 | v62.85,32.73 62.95,32.78 64,32.78 | 64,32.78 v65.55,32.78 66.65,32.78 | 66.65,32.78 v68.55,32.78 69.85,32.78 | 69.85,32.78 69.9,32.78 | 69.92,32.78 v71.65,32.78 v74.7,32.73 | v73,29.43 C35.1 v70.1,29.43 68.7,29.43 | 68.7,29.43 v67.15,29.43 v64.8,29.43 63.45,29.43 | 63.45,29.43 v61.75,29.43 | 60.5,29.43 v59.35,29.43 | v69.55,22.73 68.05,22.73 | 68.05,22.73 v66.65,22.73 65.35,22.73 | 65.35,22.73 v63.9,22.73 62.5,22.73 | 62.5,22.73 v61.15,22.73 59.9,22.73 | 59.9,22.73 v58.45,22.73 58.3,22.58 | 51.45,22.73 v52.65,22.73 v55.6,22.73 54.3,22.73 C19.1 | 51.45,22.73 v50.05,22.73 v47.25,22.73 | v47.25,22.73 v44.5,22.73 | v44.5,22.73 v41.75,22.73 | v41.75,22.73 v39.1,22.73 | v39.1,22.73 v36.1,22.73 | v36.1,22.73 v33.35,22.73 v30.6,22.73 | v30.6,22.73 v27.9,22.73 | v27.9,22.73 v25.2,22.73 23.95,22.73 | 23.95,22.73 v22.2,22.73 | 22.15,22.73 21.65,22.73 | v6.15,20.63 v4.65,20.63 4.35,20.63 3.9,20.18 | 3.9,20.18 v3.15,19.43 3.15,19.03 3.75,18.43 | 3.75,18.43 v4.6,17.58 5.75,17.58 | 5.75,17.58 5.9,17.58 v6.65,18.33 9.2,20.88 | v11.3,20.68 10.95,21.03 9.35,21.03 9.2,20.88 | 11.35,20.63 v11.3,20.68 | v14.35,20.48 14.35,21.23 14.2,21.38 11.45,21.38 11.3,21.23 v11.3,20.68 | v16.9,22.28 16.95,22.33 19.4,22.33 | 19.4,22.33 20.2,22.33 | 64,32.78 C1.1 | C5.1 34.95,22.73 v36.1,22.73 | C12.1 37.75,22.73 v39.1,22.73 | C9.1 40.35,22.73 v39.1,22.73 | v27.9,22.73 26.6,22.73 C3.1 | C14.1 29.5,22.73 v30.6,22.73 | C10.1 31.8,22.73 v30.6,22.73 | C4.1 43,22.73 v41.75,22.73 | C17.1 48.45,22.73 v47.25,22.73 | C16.1 45.75,22.73 v44.5,22.73 | C18.1 51.45,22.73 | C59.1 59.9,22.63 59.9,22.73
  Bottom 0.254: C54.1 62.5,22.68 62.5,22.73 | C55.1 65.35,22.63 65.35,22.73 | C52.1 68.05,22.58 68.05,22.73 | v27.85,16.53 27.85,16.58 29.1,16.58 | 29.1,16.58 v30.7,16.58 32.15,16.58 | 32.15,16.58 v33.4,16.58 35,16.58 | 35,16.58 v36.25,16.58 37.65,16.58 | 37.65,16.58 v39.15,16.58 C42.1 v42,16.58 43.7,16.58 | 43.7,16.58 v45,16.58 46.4,16.58 | 46.4,16.58 v47.85,16.58 49.4,16.58 | 49.4,16.58 v50.8,16.58 | 51.15,16.58 52.4,16.58 v53.85,16.58 55.3,16.58 | 55.3,16.58 v56.95,16.58 58.35,16.58 | 58.35,16.58 v60,16.58 61.4,16.58 | 61.4,16.58 62.55,16.58 | v62.95,16.58 64.35,16.58 | 64.35,16.58 65.7,16.58 | v65.8,16.58 v68.7,16.58 | v34.95,10.38 36.25,10.38 | 36.25,10.38 v37.9,10.38 39.45,10.38 | 39.45,10.38 v40.8,10.38 42.2,10.38 | 42.2,10.38 v43.75,10.38 45.2,10.38 | 45.2,10.38 v46.65,10.38 48.05,10.38 | 48.05,10.38 v49.5,10.38 51,10.38 | 51,10.38 v52.45,10.38 53.95,10.38 | 53.95,10.38 v55.5,10.38 57.1,10.38 | 57.1,10.38 v58.55,10.38 | C51.1 39.4,10.43 39.45,10.38 | C46.1 42.25,10.43 42.2,10.38 | C43.1 45.25,10.43 45.2,10.38 | C22.1 48.05,10.38 | C47.1 51,10.38 | C44.1 54,10.43 53.95,10.38 | C41.1 57.05,10.43 57.1,10.38 | C23.1 36.3,10.43 36.25,10.38 | C53.1 32.05,16.68 32.15,16.58 | C50.1 35,16.58 | C45.1 37.6,16.63 37.65,16.58 | C56.1 29.2,16.68 29.1,16.58 | C39.1 43.6,16.68 43.7,16.58 | C36.1 46.35,16.63 46.4,16.58 | C33.1 49.35,16.63 49.4,16.58 | C30.1 52.3,16.68 52.35,16.63 | C27.1 55.35,16.63 55.3,16.58 | C24.1 58.35,16.58 | C21.1 61.4,16.58 | v56.65,29.43 55.5,29.43 | 55.5,29.43 v53.85,29.43 C92.1 v50.9,29.43 49.45,29.43 | 49.45,29.43 v48,29.43 | v48,29.43 46.75,29.43 | 46.75,29.43 v45.3,29.43 44.05,29.43 | C66.1 v42.45,29.43 40.85,29.43 | 40.85,29.43 v39.55,29.43 v36.65,29.43 v33.55,29.43
  Bottom 0.254: 33.3,29.43 32.25,29.43 | 32.25,29.43 30.8,29.43 | v30.75,29.43 29.5,29.43 | 29.5,29.43 v28,29.43 | 27.9,29.43 26.8,29.43 | 26.8,29.43 v25.3,29.43 24.25,29.43 | 24.25,29.43 v22.35,29.43 | C25.1 81.45,37.43 81.4,37.43 | C37.1 84.45,37.43 84.5,37.43 | C34.1 86.42,38.26 | C32.1 24.15,29.33 24.25,29.43 | C31.1 26.7,29.33 26.8,29.43 | C26.1 29.4,29.53 29.5,29.43 | C28.1 32.15,29.53 32.25,29.43 | v48,29.43 47.7,29.43 47.65,29.48 | C29.1 46.7,29.48 46.75,29.43 | C38.1 49.45,29.43 | C89.1 55.45,29.48 55.5,29.43 | C40.1 68.65,29.38 68.7,29.43 | C99.1 66.7,32.73 66.65,32.78 | 69.85,32.78 C98.1 69.92,32.78 | C96.1 71.75,36.03 71.7,35.98 | C87.1 63.3,29.28 63.45,29.43 | C100.1 23.8,22.88 23.95,22.73 | C104.1 40.85,29.43 | C118.1 63.85,24.88 63.9,24.83 63.95,24.88 C111.1 | C85.1 5.7,17.53 5.75,17.58 | C91.1 3.71,18.39 3.75,18.43 | C88.1 3.87,20.21 3.9,20.18 | C94.1 9.2,20.88 | C93.1 18.59,23.14 19.4,22.33 | C90.1 64.35,16.58 | 69.92,32.78 69.9,32.78 | 69.9,32.78 69.85,32.83 | v80.01,37.37 78.02,37.43 | 78.02,37.43 76.82,37.43 v76.7,37.31 | C83.1 78.05,37.4 78.02,37.43
  Bottom 0.305: v50.8,16.58 51.15,16.58 | v65.8,16.58 65.7,16.58 | v62.95,16.58 62.55,16.58 | v72.3,22.73 v69.55,22.73 | 21.65,22.73 20.6,22.73 20.2,22.33 | v22.2,22.73 22.15,22.73 | v28,29.43 27.9,29.43 | v30.75,29.43 30.8,29.43 | v33.55,29.43 33.3,29.43 | v80.01,37.37 81.4,37.43 v83.15,37.37 84.5,37.43 v85.6,37.43 86.42,38.26 87.15,38.98 v87.3,38.98 | C115.1 36.25,14.85 v36.25,16.58 | C113.1 39.15,14.78 v39.15,16.58 | C116.1 42,14.77 v42,16.58 | C117.1 46.35,15.36 C36.1 | C114.1 60,14.29 v60,16.58 | C112.1 52.65,24.84 v52.65,22.73 | C110.1 v47.25,22.73 | C107.1 v30.6,22.73 | C109.1 v33.35,22.73 | C108.1 v36.1,22.73
  Bottom 0.406: v64.8,29.43 64.8,26.63 63.9,25.73 63.9,24.83 v63.9,22.73 | v68.7,16.58 68.7,18.98 | 68.7,18.98 69.55,19.83 v69.55,22.73 69.6,22.78 C102.1 | C66.1 44.05,29.43 | C95.1 39.1,26.83 39.1,26.93 | C105.1 39.1,25.33 39.1,25.43 | C97.1 52.45,14.28 52.45,14.48 | C106.1 52.45,14.18 52.45,14.13 | C103.1 68.35,19.33 68.7,18.98 | C84.1 60.55,29.43 | 60.55,29.43 60.5,29.43 | 60.55,29.43 v61.75,29.43 | v67.2,35.98 64.65,35.98 62.85,34.18 v62.85,32.73
  Bottom 0.61: 39.15,22.68 v39.1,22.73 39.1,25.43 39.1,26.93 39.1,28.98 v39.55,29.43 39.55,30.48 39,31.03 SJ1.1 | v52.45,10.38 52.45,14.13 52.45,14.48 52.45,16.53 52.4,16.58 52.35,16.63
BAT_MON  (via drill 0.3)
  Top 0.254: R25.1 R26.2 37.1,34.78 | IC1.10 44.95,49.13 v44.5,49.58
  Top 0.305: v37.4,43.68 38.2,44.48 38.2,45.58 37.8,45.98 37.8,48.78 v38.4,49.38 | R26.2 38.4,34.78 v39.9,36.28
  Bottom 0.254: v44.5,49.58 38.6,49.58 v38.4,49.38
  Bottom 0.305: v37.4,43.68 37.4,41.08 38.9,39.58 39.4,39.58 40.4,38.58 40.4,36.78 v39.9,36.28
BUTTON
  Top 0.254: SW2.B SW2.B' | R19.1 54.65,36.52 SW2.B' | IC1.39 51.65,41.63 52.8,40.48 52.8,40.28 54,39.08 54,38.31 SW2.B'
CHIP_PU
  Top 0.254: IC1.9 45.45,50.78 44.7,51.53 43.46,51.53 R8.1 43.43,51.26 43.1,50.93 40.82,50.93 Q1.3
CS
  Top 0.254: R1.1 45.7,35.58 U2.12
CSB  (via drill 0.3)
  Top 0.305: U$131.15 59.95,47.93 v59.1,48.78 | IC1.24 v43.2,38.58 | v60.6,38.88 62.6,38.88 v63.4,39.68
  Bottom 0.305: v43.2,38.58 43.2,36.18 44,35.38 48,35.38 51.5,38.88 v60.6,38.88 | v63.4,39.68 62.6,39.68 59.8,42.48 59.8,43.98 60.6,44.78 60.6,47.28 v59.1,48.78
D+
  Top 0.406: JP7.3 26,48.73 arc-34 R15.1
D-
  Top 0.406: JP7.2 26.15,49.38 arc61 R14.1
DTR  (via drill 0.3)
  Top 0.254: Q1.1 v39.05,50.38 | 37.91,54.66 35.95,54.66 U1.1
  Top 0.305: 37.91,54.66 R9.1 | v35.1,55.18 U1.1
  Bottom 0.254: v39.05,50.38 35.1,54.33 v35.1,55.18
ECG_N
  Top 0.305: R6.1 TP2.TP
  Top 0.406: H2.B4,1 90.69,43.63 90.5,43.63 90.48,43.63 85.79,38.94 77.25,38.94 75.2,40.83 75.2,48.13 73.75,49.58 TP2.TP
ECG_P  (via drill 0.3)
  Top 0.305: R3.1 TP1.TP
  Top 0.406: H1.B4,1 15.7,4.98 v26.05,15.33 | R3.1 68.65,45.58 68.65,40.63 64.4,36.38 v63.05,36.38
  Bottom 0.305: v26.05,15.33 26.05,17.33 28.25,19.68 56.8,19.68 57.1,19.98 57.1,27.03 58.4,28.33 58.4,31.68
  Bottom 0.406: 58.4,31.68 63.05,36.33 v63.05,36.38
ECGN
  Top 0.254: U$131.7 66.8,47.93 C76.2 | R6.2 C76.2 | C76.2 C74.1
ECGP
  Top 0.254: U$131.6 66.7,47.43 C76.1 R3.2
  Top 0.305: C75.1 C76.1
EN  (via drill 0.3)
  Top 0.254: U8.3 38.3,36.88 37.75,36.33 32.9,36.33 32.1,37.13 v31.05,37.13
  Top 0.406: S2.2 20.58,41.11 20.55,41.08 21.85,41.08 v22.7,41.93
  Bottom 0.406: v22.7,41.93 27.5,37.13 v31.05,37.13
FCLK
  Top 0.254: U$131.14 60.55,49.88 U$134.3
GND  (via drill 0.3)
  Top 0.178: 45.6,55.92 43.4,55.92
  Top 0.254: U$76.GND 6.8,20.22 | U$75.GND 5.4,21.11 5.4,20.13 | U$131.12 62.6,49.83 62.65,49.88 62.65,51.28 62.6,51.33 | U$131.24 62.6,45.93 U$131.THERMAL | U$131.28 64.6,44.88 64.2,45.28 64.15,45.28 63.6,45.83 | C77.2 62.95,53.69 C80.2 | C2.2 53.18,45.23 C15.2 | U2.2 42.65,34.38 | U2.3 42.5,33.88 | U2.1 42.6,34.88 | 46.65,32.28 46.1,32.28 U2.7 U2.6 | U$114.GND 60.47,11.16 60.6,11.28
  Top 0.305: U$131.24 62.6,43.08 | U$131.28 64.6,43.13 | 63.6,43.13 U$131.26 63.6,45.83 63.6,45.93 U$131.THERMAL | U$15.GND 70.98,35.21 70.98,35.24 | C58.1 38.92,48.6 39.6,49.28 | SW2.A 59.39,38.69 60.5,37.58
  Top 0.762: E1.GND 45.6,55.92 | 43.4,55.92 E1.GND2
  other vias: 44.9,43.32 46.7,43.39 48.44,43.32 48.54,41.45 46.77,41.45 45,41.55 43.23,56.12 41.96,56.12 40.69,56.12 39.42,56.12 38.15,56.12 36.88,56.12 44.5,56.12 45.77,56.12 47.8,56.12 49.07,56.12 50.34,56.12 51.61,56.12 52.88,56.12 54.15,56.12 55.42,56.12 56.69,56.12 59.23,56.12 60.3,56.12 46.15,55.2 48.56,55.2 47.16,53.07 49.7,53.07 49.07,53.96 47.42,51.8 49.58,51.8 47.42,50.53 49.58,50.53 49.68,49.26 49.88,48.19 50.85,48.22 46.15,51.8 46.45,50.53 46.15,52.97 44.5,54.85 43.23,54.85 42.16,54.9 49.83,55.1 50.34,53.96 50.97,53.07 50.85,51.8 50.85,50.53 50.85,49.26 51.61,54.85 52.88,54.85 54.15,54.85 55.42,54.85 56.69,54.85 70.25,37.28 66.8,15.43 30.7,39.63 39.2,33.63 63.6,40.83 44.3,37.18 55.1,48.68 27.95,42.63 50.4,36.28 5.45,19.23 8.6,18.68 12.85,20.58 15.7,21.38 40.15,8.93 71.25,19.03 25.05,16.73 60.1,26.23 56.4,8.48 44,50.58 42.3,37.73 33.2,39.48 61.55,32.93 62.55,26.23 67.85,26.23 89.22,40.77 75.82,38.58 69.94,44.25 28.1,55.08
  pour Bottom (isolate 0.305, rank 6): 99.9,56.48 99.9,-0.72 -0.1,-0.72 -0.1,56.48
  pour Top (isolate 0.305, rank 6): -0.1,-0.72 99.9,-0.72 99.9,56.48 -0.1,56.48
INTB  (via drill 0.3)
  Top 0.254: IC1.38 50.95,41.13 v52,40.08
  Top 0.305: U$131.21 60.15,44.93 59.7,44.48 59.7,43.58 59,42.88 v59,39.78
  Bottom 0.305: v59,39.78 52.3,39.78 v52,40.08
LED_CLK  (via drill 0.3)
  Top 0.254: U$9.C_IN 90.21,39.43 v90.7,39.43 | IC1.14 40.75,45.63 v40.4,45.28
  Bottom 0.254: v90.7,39.43 86.2,34.93 77.55,34.93 73.55,38.93 62.45,38.93 59.5,41.88 59,41.88 56.15,44.73 40.55,44.73 v40.4,45.28
LED_DATA  (via drill 0.3)
  Top 0.254: U$9.D_IN 90.52,38.58 v91.25,38.58 | IC1.15 41.45,45.13 40.35,44.03 v39.65,44.03
  Bottom 0.254: v91.25,38.58 87,34.33 77.1,34.33 73.1,38.33 62.25,38.33 59.3,41.28 58.9,41.28 55.9,44.28 39.65,44.23 v39.65,44.03
LNA_IN
  Top 0.2: IC1.2 48.95,47.83 49,47.88
  Top 0.305: 48.51,49.02 48.51,49.1 L1.1
  Top 0.61: L1.1 49,48.53 49,47.88
  Top 0.762: 48.51,49.02 C49.1
MISO  (via drill 0.3)
  Top 0.254: U$131.18 59.45,46.43 58.75,45.73 57.35,45.73 56.7,46.38 v56.25,46.93 | IC1.11 44.45,48.13 v44.05,48.53
  Bottom 0.254: v56.25,46.93 55.6,46.28 54.8,46.28 54.5,45.98 46.6,45.98 v44.05,48.53
MOSI  (via drill 0.3)
  Top 0.305: IC1.36 49.45,38.08 v49.2,37.83 | v58.4,46.63 58.7,46.93 U$131.17 | v58.3,44.18 57.8,43.68 57.8,40.98 57.4,40.58 56.2,40.58 v56.15,40.63
  Bottom 0.305: v58.3,44.18 58.3,46.53 v58.4,46.63 | 56.13,40.65 v56.15,40.63 55.9,40.88 51.6,40.88 49.2,38.48 v49.2,37.83
N$1
  Top 0.254: C8.1 44.45,38.25 IC1.26
N$3
  Top 0.254: U$119.D_IN U$104.D_OUT
N$4
  Top 0.305: R9.2 39.68,53.26 Q1.5
N$7
  Top 0.254: U$104.CL_OUT U$119.C_IN
N$9
  Top 0.254: Q1.2 39.7,51.98 39.9,52.18 41.53,52.18 R10.2
N$20
  Top 0.406: R14.2 28.1,49.09 28.8,49.78 29.7,49.78 30.02,49.46 U1.12
N$21
  Top 0.406: U1.11 29.39,47.68 29.1,47.38 27.78,47.38 R15.2
N$22
  Top 0.305: CHG2.C U3.1 | U3.1
N$24
  Top 0.254: U$9.D_OUT U$10.D_IN
N$25
  Top 0.254: U$9.CL_OUT 88.51,37.75 U$10.C_IN
N$26
  Top 0.254: U$11.D_OUT U$12.D_IN
N$27
  Top 0.254: U$12.C_IN U$11.CL_OUT
N$28
  Top 0.254: U$12.D_OUT U$13.D_IN
N$29
  Top 0.305: R16.2 CHG2.A
N$30
  Top 0.254: U$13.C_IN U$12.CL_OUT
N$31
  Top 0.305: U3.5 R17.2 | R17.2
N$32
  Top 0.254: U$14.D_IN 75.45,33.56 U$13.D_OUT
N$33
  Top 0.254: U$14.C_IN 75.25,34.78 75.6,34.78 76.5,35.68 U$13.CL_OUT
N$34
  Top 0.254: U$15.D_IN U$14.D_OUT
N$35
  Top 0.254: U$14.CL_OUT U$15.C_IN
N$36
  Top 0.254: U$18.D_IN U$15.D_OUT
N$37
  Top 0.254: U$15.CL_OUT U$18.C_IN
N$38
  Top 0.254: U$11.D_IN 86.79,34.86 U$10.D_OUT
N$39
  Top 0.254: U$11.C_IN 86.45,35.68 U$10.CL_OUT
N$40
  Top 0.254: U$19.D_OUT U$20.D_IN
N$41
  Top 0.254: U$20.C_IN U$19.CL_OUT
N$42
  Top 0.254: U$21.D_IN U$20.D_OUT
N$43
  Top 0.254: U$21.C_IN U$20.CL_OUT
N$44
  Top 0.254: U$21.D_OUT U$22.D_IN
N$45
  Top 0.254: U$22.C_IN U$21.CL_OUT
N$46
  Top 0.254: U$24.D_IN U$22.D_OUT
N$47
  Top 0.254: U$24.C_IN U$22.CL_OUT
N$48  (via drill 0.3)
  Top 0.254: U$24.D_OUT 60.67,30.31 v60.64,30.28 | v75.45,26.38 75.12,26.38 U$25.D_IN
  Bottom 0.254: v75.45,26.38 74.3,27.53 74.3,29.58 73.55,30.18 73.52,30.21 60.71,30.21 v60.64,30.28
N$50  (via drill 0.3)
  Top 0.254: U$24.CL_OUT v61.65,31.13 | v75.75,27.83 U$25.C_IN
  Bottom 0.254: v75.75,27.83 74.9,28.68 74.9,29.93 74.05,30.68 62.95,30.68 62.6,31.13 v61.65,31.13
N$56
  Top 0.254: U$27.D_OUT U$28.D_IN
N$57
  Top 0.254: U$28.C_IN U$27.CL_OUT
N$58
  Top 0.254: U$28.D_OUT U$29.D_IN
N$59
  Top 0.254: U$29.C_IN U$28.CL_OUT
N$60
  Top 0.254: U$30.D_IN U$29.D_OUT
N$61
  Top 0.254: U$30.C_IN U$29.CL_OUT
N$62
  Top 0.254: U$30.D_OUT U$31.D_IN
N$63
  Top 0.254: U$31.C_IN U$30.CL_OUT
N$64
  Top 0.254: U$120.D_IN U$119.D_OUT
N$65
  Top 0.254: U$119.CL_OUT U$120.C_IN
N$66
  Top 0.254: U$25.D_OUT U$27.D_IN
N$67
  Top 0.254: U$27.C_IN U$25.CL_OUT
N$68
  Top 0.254: U$34.D_IN U$33.D_OUT
N$69
  Top 0.254: U$33.CL_OUT U$34.C_IN
N$70
  Top 0.254: U$35.D_IN U$34.D_OUT
N$71
  Top 0.254: U$34.CL_OUT U$35.C_IN
N$72
  Top 0.254: U$36.D_IN U$35.D_OUT
N$73
  Top 0.254: U$35.CL_OUT U$36.C_IN
N$80
  Top 0.254: U$36.D_OUT U$37.D_IN
N$81
  Top 0.254: U$37.C_IN U$36.CL_OUT
N$82
  Top 0.254: U$37.D_OUT U$38.D_IN
N$83
  Top 0.254: U$38.C_IN U$37.CL_OUT
N$84
  Top 0.254: U$39.D_OUT U$40.D_IN
N$85
  Top 0.254: U$40.C_IN U$39.CL_OUT
N$86
  Top 0.254: U$40.D_OUT U$41.D_IN
N$87
  Top 0.254: U$41.C_IN U$40.CL_OUT
N$88
  Top 0.254: U$42.D_IN U$41.D_OUT
N$89
  Top 0.254: U$41.CL_OUT U$42.C_IN
N$90
  Top 0.254: U$43.D_IN U$42.D_OUT
N$91
  Top 0.254: U$42.CL_OUT U$43.C_IN
N$92
  Top 0.254: U$44.D_IN U$43.D_OUT
N$93
  Top 0.254: U$43.CL_OUT U$44.C_IN
N$94
  Top 0.254: U$39.D_IN U$38.D_OUT
N$95
  Top 0.254: U$39.C_IN U$38.CL_OUT
N$96
  Top 0.254: U$45.D_OUT U$46.D_IN
N$97
  Top 0.254: U$45.CL_OUT U$46.C_IN
N$98
  Top 0.254: U$46.D_OUT U$47.D_IN
N$99
  Top 0.254: U$47.C_IN U$46.CL_OUT
N$100
  Top 0.254: U$48.D_IN U$47.D_OUT
N$101
  Top 0.254: U$47.CL_OUT U$48.C_IN
N$102
  Top 0.254: U$49.D_IN U$48.D_OUT
N$103
  Top 0.254: U$48.CL_OUT U$49.C_IN
N$104
  Top 0.254: U$49.D_OUT U$50.D_IN
N$105
  Top 0.254: U$50.C_IN U$49.CL_OUT
N$106
  Top 0.254: U$52.D_IN U$51.D_OUT
N$107
  Top 0.254: U$51.CL_OUT U$52.C_IN
N$108
  Top 0.254: U$52.D_OUT U$53.D_IN
N$109
  Top 0.254: U$53.C_IN U$52.CL_OUT
N$110
  Top 0.254: U$53.D_OUT U$54.D_IN
N$111
  Top 0.254: U$54.C_IN U$53.CL_OUT
N$112
  Top 0.254: U$55.D_IN U$54.D_OUT
N$113
  Top 0.254: U$54.CL_OUT U$55.C_IN
N$114
  Top 0.254: U$55.D_OUT U$56.D_IN
N$115
  Top 0.254: U$56.C_IN U$55.CL_OUT
N$116
  Top 0.305: U$50.D_OUT 73.4,25.31 73.75,24.96 73.75,22.13 71.87,20.26 U$51.D_IN
N$117
  Top 0.305: U$51.C_IN 71.95,21.08 73.25,22.38 73.25,24.18 72.95,24.48 U$50.CL_OUT
N$118  (via drill 0.3)
  Top 0.254: U$19.D_IN v75.9,29.38 | v64.45,34.28 65.55,34.28 66.27,33.56 U$18.D_OUT
  Bottom 0.254: v75.9,29.38 75.9,33.58 75.2,34.28 68.35,34.28 67.95,33.88 64.85,33.88 v64.45,34.28
N$119  (via drill 0.3)
  Top 0.254: U$18.CL_OUT 66.5,34.38 v65.8,35.08 | v76.8,31.13 U$19.C_IN
  Bottom 0.254: v65.8,35.08 75.35,35.08 76.85,33.58 76.85,31.18 v76.8,31.13
N$120
  Top 0.254: U$33.D_IN U$32.D_OUT
N$121
  Top 0.254: U$32.CL_OUT U$33.C_IN
N$122
  Top 0.254: U$44.CL_OUT U$45.C_IN
N$123
  Top 0.254: U$45.D_IN U$44.D_OUT
N$124
  Top 0.254: U$57.D_OUT U$58.D_IN
N$125
  Top 0.254: U$58.C_IN U$57.CL_OUT
N$126
  Top 0.254: U$59.D_IN U$58.D_OUT
N$127
  Top 0.254: U$58.CL_OUT U$59.C_IN
N$128
  Top 0.254: U$59.D_OUT U$60.D_IN
N$129
  Top 0.254: U$60.C_IN U$59.CL_OUT
N$130
  Top 0.254: U$60.D_OUT U$61.D_IN
N$131
  Top 0.254: U$61.C_IN U$60.CL_OUT
N$132
  Top 0.254: U$61.D_OUT U$62.D_IN
N$133
  Top 0.254: U$62.C_IN U$61.CL_OUT
N$134
  Top 0.254: U$64.D_IN U$63.D_OUT
N$135
  Top 0.254: U$63.CL_OUT U$64.C_IN
N$136
  Top 0.254: U$65.D_IN U$64.D_OUT
N$137
  Top 0.254: U$64.CL_OUT U$65.C_IN
N$138
  Top 0.254: U$65.D_OUT U$66.D_IN
N$139
  Top 0.254: U$66.C_IN U$65.CL_OUT
N$140
  Top 0.254: U$66.D_OUT U$67.D_IN
N$141
  Top 0.254: U$67.C_IN U$66.CL_OUT
N$142
  Top 0.254: U$67.D_OUT 25.12,20.28 24.5,20.28 23.34,21.44 19.85,21.44 U$68.D_IN
N$143
  Top 0.254: U$67.CL_OUT 24.46,21.13 23.64,21.95 20.48,21.95 20.15,22.28 19.31,22.28 U$68.C_IN
N$144
  Top 0.254: U$63.D_IN U$62.D_OUT
N$145
  Top 0.254: U$62.CL_OUT U$63.C_IN
N$146
  Top 0.254: U$56.CL_OUT U$57.C_IN
N$147
  Top 0.254: U$57.D_IN U$56.D_OUT
N$148
  Top 0.254: U$70.D_IN 14.33,17.93 U$69.D_OUT
N$149
  Top 0.254: U$69.CL_OUT 12.82,18.73 U$70.C_IN
N$150
  Top 0.254: U$70.D_OUT 10.26,17.98 U$71.D_IN
N$151
  Top 0.254: U$71.C_IN 9.91,18.8 U$70.CL_OUT
N$152
  Top 0.254: U$71.D_OUT 7.04,15.06 U$72.D_IN
N$153
  Top 0.254: U$71.CL_OUT 6.69,15.88 U$72.C_IN
N$154
  Top 0.254: U$72.D_OUT 4.11,15.06 U$73.D_IN
N$155
  Top 0.254: U$72.CL_OUT 4.45,15.88 U$73.C_IN
N$156
  Top 0.254: U$73.D_OUT 1.15,18.02 1.15,20.8 U$74.D_IN
N$157
  Top 0.254: U$73.CL_OUT 1.7,18.64 1.7,20.18 U$74.C_IN
N$158
  Top 0.254: U$75.D_OUT 6.74,23.26 U$76.D_IN
N$159
  Top 0.254: U$75.CL_OUT 6.65,22.43 7.15,21.93 7.15,21.69 U$76.C_IN
N$160  (via drill 0.3)
  Top 0.254: U$76.D_OUT 9.87,20.13 v10.25,20.13 | v25.1,19.18 25.12,19.16 U$77.D_IN
  Bottom 0.254: v25.1,19.18 22.55,21.73 17.55,21.73 15.55,19.73 10.65,19.73 v10.25,20.13
N$161  (via drill 0.3)
  Top 0.254: U$76.CL_OUT 9.3,19.54 v9.35,19.48 | v25.05,17.98 25.4,18.33 U$77.C_IN
  Bottom 0.254: v9.35,19.48 9.55,19.28 15.95,19.28 17.75,21.08 22.3,21.08 24.15,19.23 24.15,18.78 24.95,17.98 v25.05,17.98
N$162
  Top 0.254: U$77.D_OUT U$78.D_IN
N$163
  Top 0.254: U$78.C_IN U$77.CL_OUT
N$164
  Top 0.254: U$78.D_OUT U$79.D_IN
N$165
  Top 0.254: U$79.C_IN U$78.CL_OUT
N$166
  Top 0.254: U$79.D_OUT U$80.D_IN
N$167
  Top 0.254: U$80.C_IN U$79.CL_OUT
N$168
  Top 0.254: U$74.D_OUT 3.28,22.93 3.9,22.93 4.22,23.26 U$75.D_IN
N$169
  Top 0.254: U$75.C_IN 3.95,22.43 U$74.CL_OUT
N$170
  Top 0.254: U$68.CL_OUT 18.1,20.64 16.45,18.98 U$69.C_IN
N$171
  Top 0.254: U$68.D_OUT 16.36,18.16 U$69.D_IN
N$172
  Top 0.305: U$82.D_IN U$81.D_OUT
N$173
  Top 0.305: U$82.C_IN U$81.CL_OUT
N$174
  Top 0.305: U$82.D_OUT U$83.D_IN
N$175
  Top 0.305: U$83.C_IN U$82.CL_OUT
N$176
  Top 0.305: U$83.D_OUT U$84.D_IN
N$177
  Top 0.305: U$84.C_IN U$83.CL_OUT
N$178
  Top 0.305: U$84.D_OUT U$85.D_IN
N$179
  Top 0.305: U$85.C_IN U$84.CL_OUT
N$180
  Top 0.305: U$85.D_OUT U$86.D_IN
N$181
  Top 0.305: U$86.C_IN U$85.CL_OUT
N$182
  Top 0.305: U$88.D_IN U$87.D_OUT
N$183
  Top 0.305: U$87.CL_OUT U$88.C_IN
N$184
  Top 0.305: U$89.D_IN U$88.D_OUT
N$185
  Top 0.305: U$88.CL_OUT U$89.C_IN
N$186
  Top 0.305: U$89.D_OUT U$90.D_IN
N$187
  Top 0.305: U$90.C_IN U$89.CL_OUT
N$188
  Top 0.305: U$91.D_IN U$90.D_OUT
N$189
  Top 0.305: U$90.CL_OUT U$91.C_IN
N$190
  Top 0.254: 66.87,13.76 66.97,13.86 | 66.97,13.86 70.45,17.33 70.45,18.03 69.32,19.16 U$91.D_OUT | U$92.D_IN 66.97,13.86
N$191  (via drill 0.3)
  Top 0.254: U$91.CL_OUT 69.05,18.33 v69.6,17.78 | v65.2,14.68 U$92.C_IN
  Bottom 0.254: v69.6,17.78 69.6,16.48 66.85,13.73 66.15,13.73 v65.2,14.68
N$192
  Top 0.305: U$86.D_OUT U$87.D_IN
N$193
  Top 0.305: U$87.C_IN U$86.CL_OUT
N$194
  Top 0.305: U$81.C_IN U$80.CL_OUT
N$195
  Top 0.305: U$80.D_OUT U$81.D_IN
N$196
  Top 0.254: U$94.D_IN U$93.D_OUT
N$197
  Top 0.254: U$93.CL_OUT U$94.C_IN
N$198
  Top 0.254: U$94.D_OUT U$95.D_IN
N$199
  Top 0.254: U$95.C_IN U$94.CL_OUT
N$200
  Top 0.254: U$95.D_OUT U$96.D_IN
N$201
  Top 0.254: U$96.C_IN U$95.CL_OUT
N$202
  Top 0.254: U$96.D_OUT U$97.D_IN
N$203
  Top 0.254: U$97.C_IN U$96.CL_OUT
N$204
  Top 0.254: U$98.D_IN U$97.D_OUT
N$205
  Top 0.254: U$97.CL_OUT U$98.C_IN
N$206
  Top 0.254: U$100.D_IN U$99.D_OUT
N$207
  Top 0.254: U$99.CL_OUT U$100.C_IN
N$208
  Top 0.254: U$100.D_OUT U$101.D_IN
N$209
  Top 0.254: U$101.C_IN U$100.CL_OUT
N$210
  Top 0.254: U$101.D_OUT U$102.D_IN
N$211
  Top 0.254: U$102.C_IN U$101.CL_OUT
N$212
  Top 0.254: U$102.D_OUT U$103.D_IN
N$213
  Top 0.254: U$103.C_IN U$102.CL_OUT
N$214
  Top 0.254: U$121.D_IN U$120.D_OUT
N$215
  Top 0.254: U$120.CL_OUT U$121.C_IN
N$216
  Top 0.254: U$98.D_OUT U$99.D_IN
N$217
  Top 0.254: U$99.C_IN U$98.CL_OUT
N$218
  Top 0.254: U$105.D_OUT U$106.D_IN
N$219
  Top 0.254: U$106.C_IN U$105.CL_OUT
N$220
  Top 0.254: U$107.D_IN U$106.D_OUT
N$221
  Top 0.254: U$106.CL_OUT U$107.C_IN
N$222
  Top 0.254: U$108.D_IN U$107.D_OUT
N$223
  Top 0.254: U$107.CL_OUT U$108.C_IN
N$224
  Top 0.254: U$108.D_OUT U$109.D_IN
N$225
  Top 0.254: U$109.C_IN U$108.CL_OUT
N$226
  Top 0.254: U$110.D_IN U$109.D_OUT
N$227
  Top 0.254: U$109.CL_OUT U$110.C_IN
N$228
  Top 0.254: U$112.D_IN U$111.D_OUT
N$229
  Top 0.254: U$111.CL_OUT U$112.C_IN
N$230
  Top 0.254: U$113.D_IN U$112.D_OUT
N$231
  Top 0.254: U$113.C_IN U$112.CL_OUT
N$232
  Top 0.254: U$114.D_IN U$113.D_OUT
N$233
  Top 0.254: U$114.C_IN U$113.CL_OUT
N$234  (via drill 0.3)
  Top 0.254: v63.25,12.78 61.42,12.78 U$114.D_OUT | v54.8,8.58 53.92,7.71 U$115.D_IN
  Bottom 0.254: v63.25,12.78 60,9.53 55.75,9.53 v54.8,8.58
N$235
  Top 0.254: U$114.CL_OUT 61.9,11.98 61.95,11.98 | 61.75,10.38 61.35,10.38 61.35,10.33 60.68,9.73 59.09,9.68 58.8,9.39 54.41,9.39 53.55,8.53 U$115.C_IN
  Top 0.305: 61.75,10.38 62.2,10.83 62.2,11.68 61.9,11.98
N$236
  Top 0.254: U$116.D_IN U$115.D_OUT
N$237
  Top 0.254: U$115.CL_OUT U$116.C_IN
N$238
  Top 0.254: U$111.D_IN U$110.D_OUT
N$239
  Top 0.254: U$110.CL_OUT U$111.C_IN
N$240
  Top 0.254: U$93.C_IN U$92.CL_OUT
N$241
  Top 0.254: U$92.D_OUT U$93.D_IN
N$242  (via drill 0.3)
  Top 0.254: U$105.C_IN v32.45,11.98 | v29.25,14.83 U$103.CL_OUT
  Bottom 0.254: v32.45,11.98 32.45,12.78 U$103.CL_OUT v29.25,14.83
N$243
  Top 0.254: U$105.D_IN 30.87,12.81 30.55,13.13 U$103.D_OUT
N$244
  Top 0.254: U$118.D_IN U$117.D_OUT
N$245
  Top 0.254: U$117.CL_OUT U$118.C_IN
N$246
  Top 0.254: U$121.D_OUT U$122.D_IN
N$247
  Top 0.254: U$122.C_IN U$121.CL_OUT
N$248
  Top 0.254: U$116.D_OUT U$117.D_IN
N$249
  Top 0.254: U$117.C_IN U$116.CL_OUT
N$250
  Top 0.254: U$123.D_IN U$122.D_OUT
N$251
  Top 0.254: U$122.CL_OUT U$123.C_IN
N$252
  Top 0.254: U$124.D_OUT U$125.D_IN
N$253
  Top 0.254: U$124.CL_OUT U$125.C_IN
N$254
  Top 0.254: U$126.D_IN U$125.D_OUT
N$255
  Top 0.254: U$125.CL_OUT U$126.C_IN
N$256
  Top 0.254: U$127.D_IN U$126.D_OUT
N$257
  Top 0.254: U$126.CL_OUT U$127.C_IN
N$258
  Top 0.254: U$128.D_IN U$127.D_OUT
N$259
  Top 0.254: U$127.CL_OUT U$128.C_IN
N$260
  Top 0.254: U$129.D_IN U$128.D_OUT
N$261
  Top 0.254: U$128.CL_OUT U$129.C_IN
N$262
  Top 0.254: U$124.D_IN U$123.D_OUT
N$263
  Top 0.254: U$124.C_IN U$123.CL_OUT
N$264
  Top 0.254: U$130.D_IN U$31.D_OUT
N$265
  Top 0.254: U$31.CL_OUT U$130.C_IN
N$266
  Top 0.254: U$130.CL_OUT U$104.C_IN
N$267
  Top 0.254: U$104.D_IN U$130.D_OUT
N$268
  Top 0.305: U$129.D_OUT 21.12,27.01 20.7,26.58 U$32.D_IN
N$269
  Top 0.305: U$129.CL_OUT 20.75,27.83 19.9,26.98 19.9,24.83 20.25,24.48 U$32.C_IN
N$270
  Top 0.254: C68.1 64,52.28 63.7,51.98 63.7,50.98 63.1,50.38 U$131.11
N$271
  Top 0.254: U$131.9 64.1,49.88 64.4,50.18 65.5,50.18 65.8,50.48 C20.1
N$272
  Top 0.254: C20.2 63.6,50.18 U$131.10
N$273
  Top 0.254: 62.1,43.18 U$131.23
  Top 0.305: 62.1,43.18 62.1,41.93 C70.1
N$274
  Top 0.254: U$131.25 63.1,42.88 65,40.98 C71.1
N$275
  Top 0.254: C73.1 64.45,42.38 64.1,42.73 U$131.27
RTS
  Top 0.254: Q1.4 41.3,53.24 | 41.3,53.24 42.09,53.24 R10.1 | 34.47,53.36 U1.2 34.47,54.66 34.25,54.88 34.25,55.58 34.75,56.08 35.45,56.08 36.15,55.38 40.6,55.38 41.3,54.68 41.3,53.24
RXD  (via drill 0.3)
  Top 0.305: R13.2 54.85,44.98 v55.35,45.48 | U1.4 33.2,55.29 v33.25,55.33
  Bottom 0.254: v55.35,45.48 42.65,45.48
  Bottom 0.305: 42.65,45.48 41.7,45.48 40.5,46.68 38.4,46.68 37.6,47.48 37.6,50.18 33.25,54.53 v33.25,55.33
SCL  (via drill 0.3)
  Top 0.254: IC1.42 v52.8,43.13
  Top 0.305: U2.13 44.95,36.28 v45.25,36.58
  Top 0.406: R7.1 45.55,36.88 v45.25,36.58
  Bottom 0.254: v45.25,36.58 51.8,43.13 v52.8,43.13
SCLK  (via drill 0.3)
  Top 0.254: v57.3,44.68 56.92,44.31 v56.92,41.51 | U$131.16 57.65,47.43 v57.6,47.38
  Top 0.305: IC1.35 48.95,38.83 48.25,38.13 v47.95,38.13
  Bottom 0.254: v57.3,44.68 57.3,47.08 v57.6,47.38 | v47.95,38.13 51.32,41.51 v56.92,41.51
SDA  (via drill 0.3)
  Top 0.254: IC1.16 42.15,44.63 v40.1,42.73 | U2.14 44.45,35.53 44.2,35.78 41.65,35.78 R4.1 41.2,36.23 v41.2,37.73
  Bottom 0.254: v40.1,42.73 40.1,39.83 41.2,38.73 v41.2,37.73
TRACE_ANT2
  Top 0.178: E1.ANT 46.78,56.3
  Top 0.762: 46.78,56.3 arc46 47.32,55.13 arc-35 C48.1 arc33 48.36,53.07 arc-37 48.48,52.77 48.48,52.42 C49.2
TXD  (via drill 0.3)
  Top 0.254: R12.2 54.9,40.63 56.07,41.8 v56.07,42.34
  Top 0.305: v39.2,40.63 39.55,40.28 v41.45,40.28 | U1.20 35.1,47.88 37.3,45.68 v37.3,45.18
  Bottom 0.254: v41.45,40.28 43.95,42.53 50.2,42.53 51.5,43.83 55.5,43.83 56.07,43.26 v56.07,42.34
  Bottom 0.305: v39.2,40.63 39.2,43.23 39.15,43.28 39.1,43.28 37.3,45.08 v37.3,45.18
U0RXD
  Top 0.254: IC1.40 51.95,42.13 53.35,40.73 R12.1
U0TXD
  Top 0.254: IC1.41 52.15,42.63 52.8,41.98 R13.1
VBAT  (via drill 0.3)
  Top 0.406: U3.3 C65.1 | R25.2 33.4,33.08 Q2.3
  Top 0.813: C65.1 v24.4,35.89 | Q2.3 33.35,34.43 v31.9,35.88
  Bottom 0.813: TP5.TP-1 v24.4,35.89 v31.89,35.89 v31.9,35.88
VIN  (via drill 0.3)
  Top 0.305: S2.3 v22.9,43.78
  Top 0.406: C63.1 D1.C 30.95,31.88 Q2.2 | U8.1
  Top 0.61: U8.1 35.6,38.18
  Top 0.813: Q2.2 32.15,32.18 v33.3,31.03 | v33.3,38.18 C72.2 35.6,38.18
  Bottom 0.305: v22.9,43.78 28.5,38.18 v33.3,38.18
  Bottom 0.61: SJ1.2 v33.3,31.03
  Bottom 0.813: v33.3,31.03 v33.3,38.18
VUSB  (via drill 0.3)
  Top 0.254: 26.78,50.72 JP7.1
  Top 0.305: C60.1 C61.1 31.93,47.1 U1.15 | U1.15 31.9,48.42 31.9,48.33 | 26.78,50.72 26.8,50.73 | U1.15 31.93,49.97 v32.7,50.73
  Top 0.406: R16.1 v31,44.53
  Top 0.61: 26.8,50.73 27.45,50.73 v28.7,51.98 | v31.9,40.28 31.9,39.08 31.25,38.43 U3.4 | U3.4 C64.1 D1.A | U3.4 | D1.A 31.15,34.18 Q2.1 | D1.A 27.55,34.18 R23.2
  Bottom 0.305: v32.7,50.73 32.7,50.53 31.9,49.73
  Bottom 0.406: v31,44.53 31.85,44.53 31.9,44.58
  Bottom 0.61: v28.7,51.98 30.05,51.98 31.9,50.13 31.9,49.73 31.9,44.58 v31.9,40.28

## Text on the board
tPlace: protocentral.com | R17 | HOLD HERE
bPlace: protocentral.com | pc_badge_hrv | v1.0